# EAGLE design picostepseq (EAGLE 9.6.2)
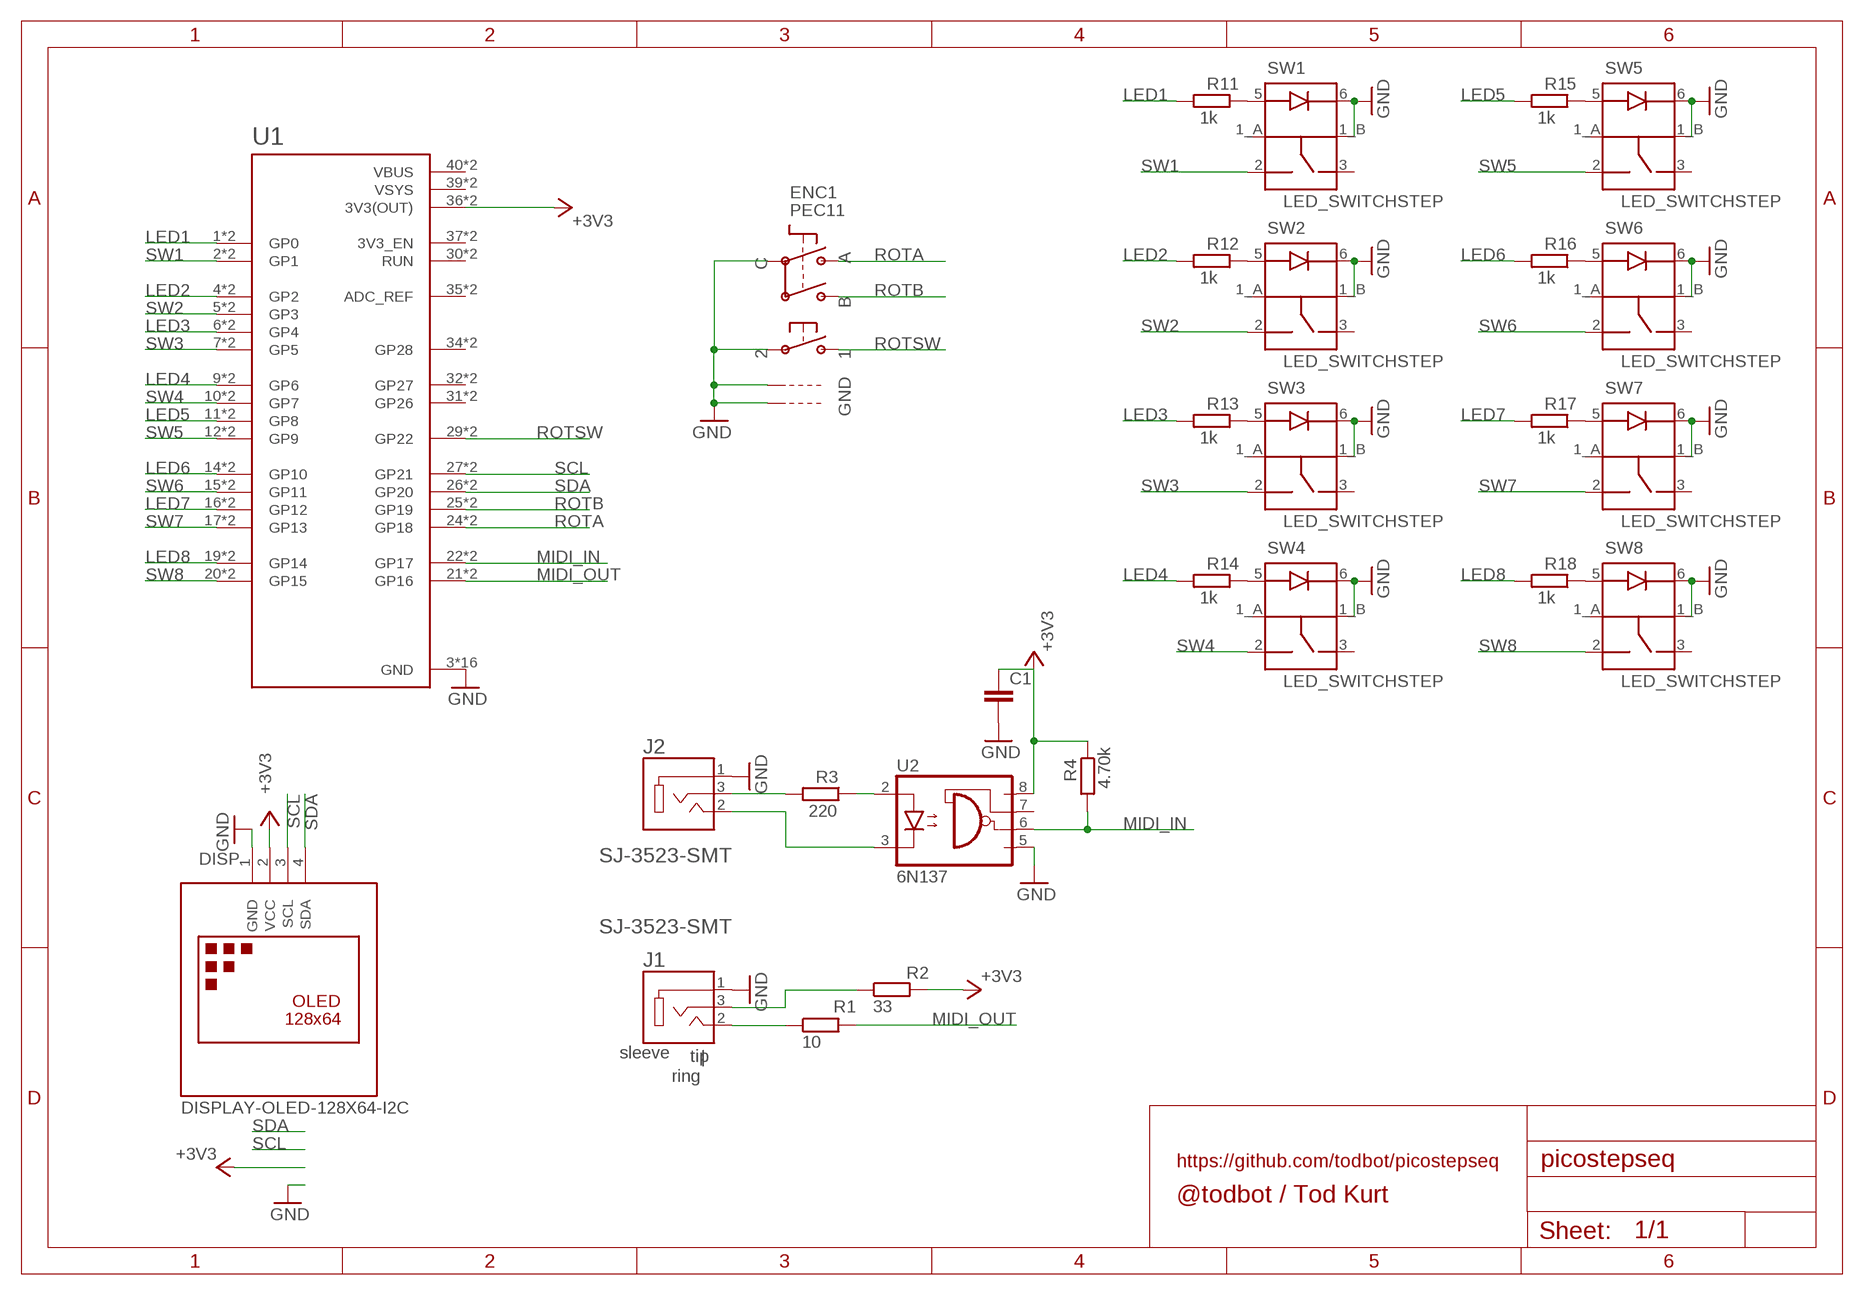
[diagram p0: schematic, sheet 1]

## Parts
C1  C-EU025-025X050  [C025-025X050]
DISP  DISPLAY-OLED-128X64-I2C  [DISPLAY-OLED-128X64-I2C]
ENC1  PEC11  ENCODER_PLUS_SWITCH_BOURNS_PEC11  [PEC11+SWITCH]
J1  SJ-3523-SMT  [CUI_SJ-3523-SMT]
J2  SJ-3523-SMT  [CUI_SJ-3523-SMT]
R1  10  R-EU_0204/7  [0204/7]
R2  33  R-EU_0204/7  [0204/7]
R3  220  R-EU_0204/7  [0204/7]
R4  4.70k  R-EU_0204/7  [0204/7]
R11  1k  R-EU_0204/7  [0204/7]
R12  1k  R-EU_0204/7  [0204/7]
R13  1k  R-EU_0204/7  [0204/7]
R14  1k  R-EU_0204/7  [0204/7]
R15  1k  R-EU_0204/7  [0204/7]
R16  1k  R-EU_0204/7  [0204/7]
R17  1k  R-EU_0204/7  [0204/7]
R18  1k  R-EU_0204/7  [0204/7]
SW1  LED_SWITCHSTEP  [LED_SWITCH_STEP]
SW2  LED_SWITCHSTEP  [LED_SWITCH_STEP]
SW3  LED_SWITCHSTEP  [LED_SWITCH_STEP]
SW4  LED_SWITCHSTEP  [LED_SWITCH_STEP]
SW5  LED_SWITCHSTEP  [LED_SWITCH_STEP]
SW6  LED_SWITCHSTEP  [LED_SWITCH_STEP]
SW7  LED_SWITCHSTEP  [LED_SWITCH_STEP]
SW8  LED_SWITCHSTEP  [LED_SWITCH_STEP]
U1  RASPBERRY_PICO-NO_DEBUG  [PICO-PKG-NO_DEBUG]
U2  6N137  [DIL08]

## Nets
+3V3: C1.1 DISP.2(VCC) R2.2 R4.1 U1.36(3V3(OUT)) U1.P$36(3V3(OUT)) U2.8(VCC)
GND: C1.2 DISP.1(GND) ENC1.P$2 ENC1.P$C ENC1.P$GND1 ENC1.P$GND2 J1.1 J2.1 SW1.1_B SW1.6 SW2.1_B SW2.6 SW3.1_B SW3.6 SW4.1_B SW4.6 SW5.1_B SW5.6 SW6.1_B SW6.6 SW7.1_B SW7.6 SW8.1_B SW8.6 U1.3(GND) U1.8(GND) U1.13(GND) U1.18(GND) U1.23(GND) U1.28(GND) U1.33(GND) U1.38(GND) U1.P$3(GND) U1.P$8(GND) U1.P$13(GND) U1.P$18(GND) U1.P$23(GND) U1.P$28(GND) U1.P$33(GND) U1.P$38(GND) U2.5(GND)
LED1: R11.2 U1.1(GP0) U1.P$1(GP0)
LED2: R12.2 U1.4(GP2) U1.P$4(GP2)
LED3: R13.2 U1.6(GP4) U1.P$6(GP4)
LED4: R14.2 U1.9(GP6) U1.P$9(GP6)
LED5: R15.2 U1.11(GP8) U1.P$11(GP8)
LED6: R16.2 U1.14(GP10) U1.P$14(GP10)
LED7: R17.2 U1.16(GP12) U1.P$16(GP12)
LED8: R18.2 U1.19(GP14) U1.P$19(GP14)
MIDI_IN: R4.2 U1.22(GP17) U1.P$22(GP17) U2.6(VO)
MIDI_OUT: R1.2 U1.21(GP16) U1.P$21(GP16)
N$1: J1.2 R1.1
N$2: R3.1 U2.2(A)
N$4: J2.2 U2.3(C)
N$5: R11.1 SW1.5
N$6: R12.1 SW2.5
N$7: R13.1 SW3.5
N$8: R14.1 SW4.5
N$9: R15.1 SW5.5
N$10: R16.1 SW6.5
N$11: R17.1 SW7.5
N$12: R18.1 SW8.5
N$13: J1.3 R2.1
N$14: J2.3 R3.2
ROTA: ENC1.P$A U1.24(GP18) U1.P$24(GP18)
ROTB: ENC1.P$B U1.25(GP19) U1.P$25(GP19)
ROTSW: ENC1.P$1 U1.29(GP22) U1.P$29(GP22)
SCL: DISP.3(SCL) U1.27(GP21) U1.P$27(GP21)
SDA: DISP.4(SDA) U1.26(GP20) U1.P$26(GP20)
SW1: SW1.2 U1.2(GP1) U1.P$2(GP1)
SW2: SW2.2 U1.5(GP3) U1.P$5(GP3)
SW3: SW3.2 U1.7(GP5) U1.P$7(GP5)
SW4: SW4.2 U1.10(GP7) U1.P$10(GP7)
SW5: SW5.2 U1.12(GP9) U1.P$12(GP9)
SW6: SW6.2 U1.15(GP11) U1.P$15(GP11)
SW7: SW7.2 U1.17(GP13) U1.P$17(GP13)
SW8: SW8.2 U1.20(GP15) U1.P$20(GP15)
Unconnected: SW1.1_A SW1.3 SW2.1_A SW2.3 SW3.1_A SW3.3 SW4.1_A SW4.3 SW5.1_A SW5.3 SW6.1_A SW6.3 SW7.1_A SW7.3 SW8.1_A SW8.3 U1.30(RUN) U1.31(GP26) U1.32(GP27) U1.34(GP28) U1.35(ADC_REF) U1.37(3V3_EN) U1.P$30(RUN) U1.P$31(GP26) U1.P$32(GP27) U1.P$34(GP28) U1.P$35(ADC_REF) U1.P$37(3V3_EN) U2.7(VE)

## Notes on the sheet
- sleeve | tip
- |
  ring
- https://github.com/todbot/picostepseq
- @todbot / Tod Kurt

## Power pins joined to a net without a drawn wire
VBUS: U1.40(VBUS) U1.P$40(VBUS)
VSYS: U1.39(VSYS) U1.P$39(VSYS)

## Library data of the parts
C1 = rcl:C-EU: CAPACITOR, European symbol; SPICEPREFIX: C
DISP = diy-modules:DISPLAY-OLED-128X64-I2C: 128x64 Dot Matrix OLED Module based on SSD1306 chip Variant with I2C interface More details available here: http://www.instructables.com/id/Monochrome-096-i2c-OLED-display-with-arduino-SSD13/ SSD1306 datasheet: https://cdn-shop.adafruit.com/datasheets/SSD1306.pdf Click here to find device on ebay.com <http://www.ebay.com/sch/oled+display+128x64+iic> Note: There are two variants: I2C and SPI. Search for the proper version.
ENC1 = adafruit_electromech:ENCODER_PLUS_SWITCH: Rotary Encoder with Built-In Switch PEC11 - 24 Step, PEC11-4215F-S24 - http://www.adafruit.com/products/377
J1 J2 = SJ-3523-SMT:SJ-3523-SMT: Audio Jack Connector 3.5 mm Low Profile Surface Mount Stereo Jack, 3 Pin Right-Angle; CUI_PURCHASE_URL: https://www.cuidevices.com/product/interconnect/connectors/audio-connectors/jacks/sj-352x-smt-series?utm_source=snapeda.com&utm_medium=referral&utm_campaign=snapedaBOM; DESCRIPTION: 3.5 mm, Stereo, Right Angle, Surface Mount (SMT), 3 Conductors, 0~1 Internal Switches, Audio Jack Connector; DIGI-KEY_PART_NUMBER: CP-3523SJCT-ND; MF: CUI Devices; MP: SJ-3523-SMT-TR; PACKAGE: None; PURCHASE-URL: https://pricing.snapeda.com/search/part/SJ-3523-SMT-TR/?ref=eda
R1-R4 R11-R18 = rcl:R-EU_: RESISTOR, European symbol; SPICEPREFIX: R
SW1-SW8 = todstuff:LED_SWITCH: Step switch with LED, like on old drum machines https://www.adafruit.com/product/5519
U1 = RpiPico:RASPBERRY_PICO-NO_DEBUG
U2 = optocoupler:6N137: MOTOROLA OPTO COUPLER; MPN: 6N137; OC_FARNELL: 1328376; OC_NEWARK: 52M1895

## Board
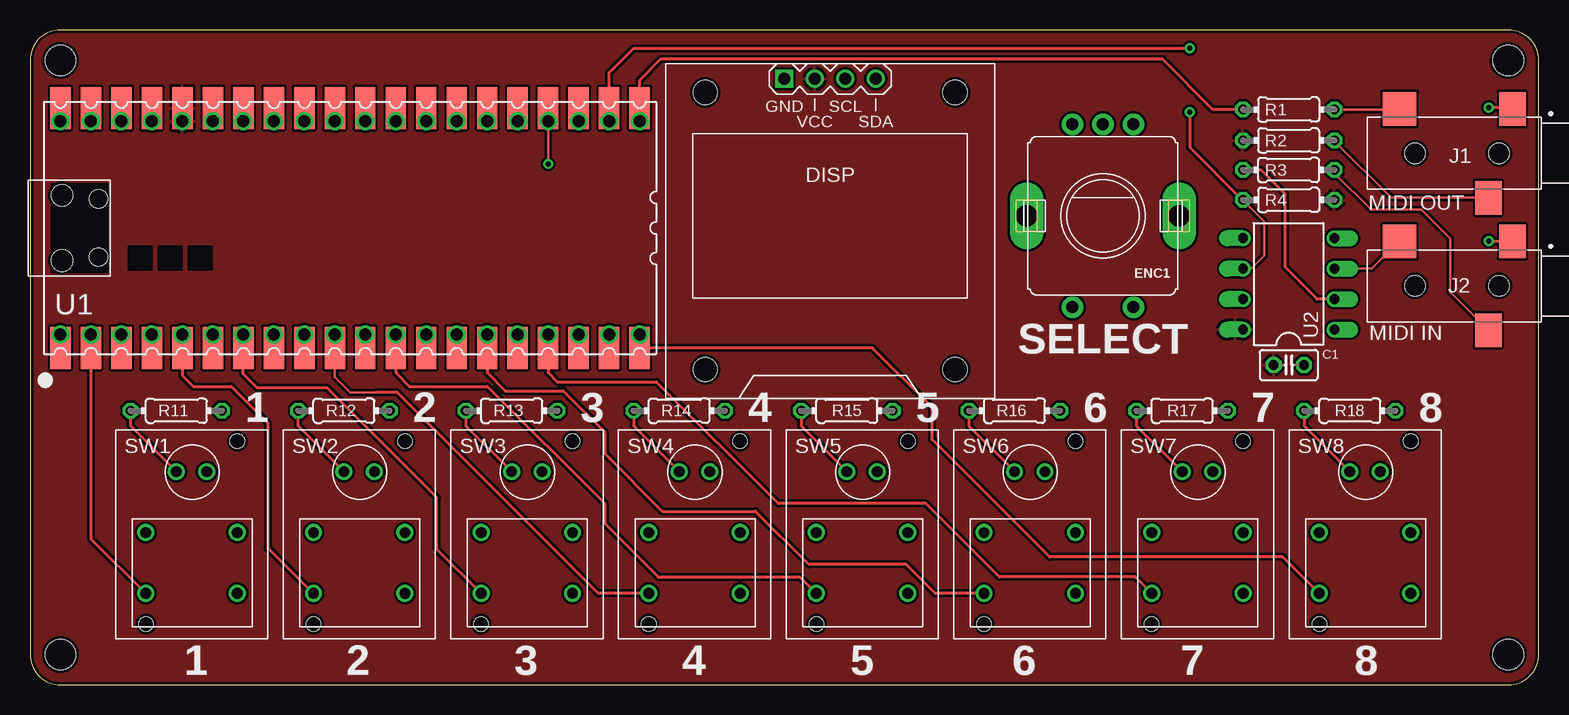
[diagram p1: board, top side]
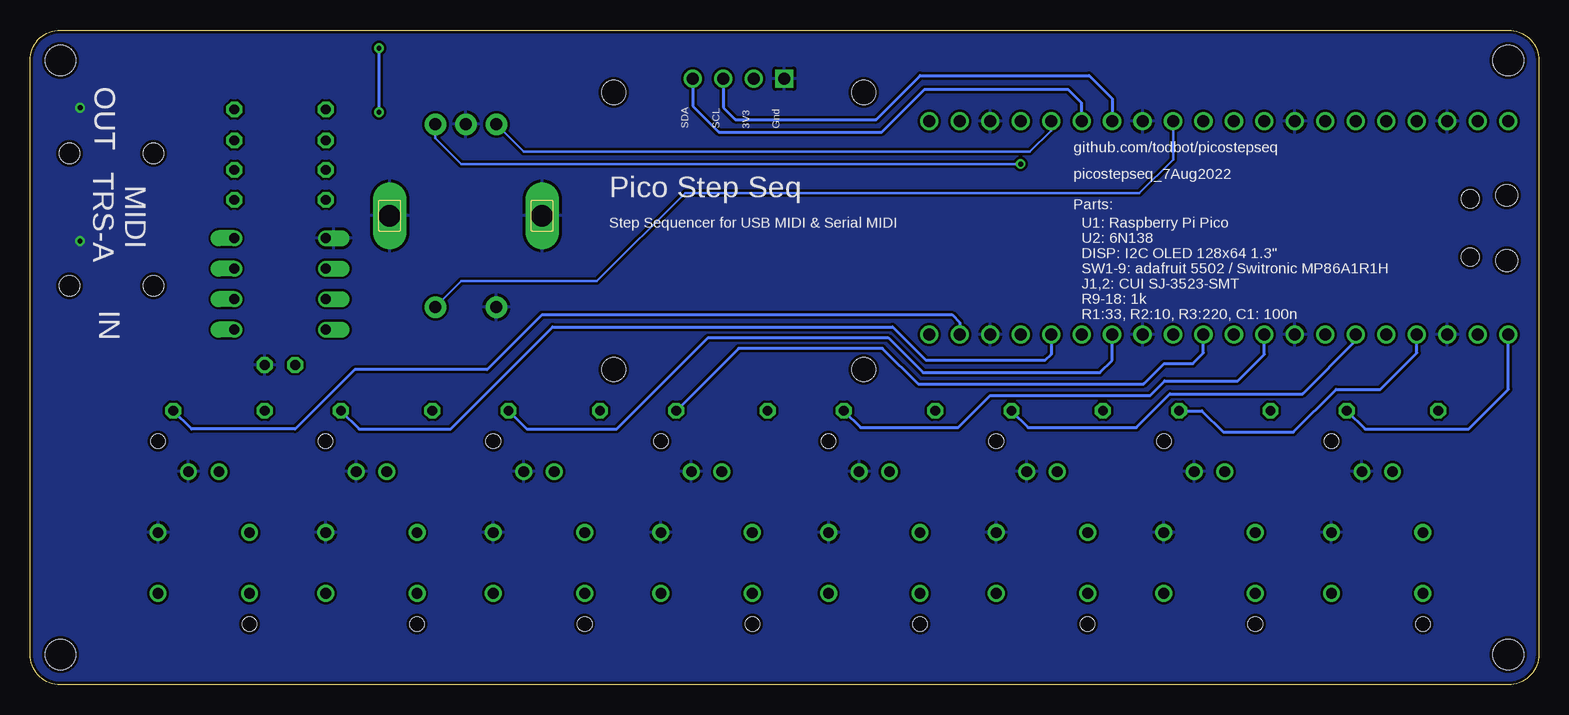
[diagram p2: board, bottom side, seen from below]

Size 125.73 x 54.61 mm. Coordinates in mm from the lower left corner, seen from the top.
Outline: 0,52.07 0,2.54 arc90 2.54,0 123.19,0 arc90 125.73,2.54 125.73,52.07 arc90 123.19,54.61 2.54,54.61 arc90 0,52.07
Copper layers (1*16): Top 0.035mm / dielectric 1.5mm / Bottom 0.035mm
Design rules "adafruit-rules-20180530": minimum track width 8mil, minimum drill 16mil, track to track 8mil, track to pad 8mil, pad to pad 8mil, via to via 8mil, smd to smd 8mil, copper to edge 10mil, drill to drill 8mil, minimum pad ring 10mil, minimum via ring 8mil, stop-mask expansion 4mil, vias tented up to drill 20mil, thermal gap 10mil
Holes 2.54 mm at 2.54,2.54 123.19,2.54 123.19,52.07 2.54,52.07

### Footprints (pad centres in the part's own frame; a part is rotated, then mirrored left to right if it is on the bottom)
C025-025X050 = drill 0.813 octagon: 1 -1.27,0; 2 1.27,0
DISPLAY-OLED-128X64-I2C = drill 1 square: 1 -3.81,12.7 | drill 1: 2 -1.27,12.7; 3 1.27,12.7; 4 3.81,12.7 | hole 2: -10.414,11.557; 10.414,11.557; 10.414,-11.557; -10.414,-11.557
PEC11+SWITCH = drill 1 pad 1.8: P$1 -2.54,7.62; P$2 2.54,7.62; P$A -2.54,-7.62; P$B 2.54,-7.62; P$C 0,-7.62 | drill 1.8 pad 2.8 long: P$GND1 -6.35,0; P$GND2 6.35,0
CUI_SJ-3523-SMT = smd 2.2 x 2.8: 1 -1.1,-3.7; 3 0.9,3.7 | smd 2.8 x 2.8: 2 8.3,-3.7 | hole 1.7: 0,0; 7,0
0204/7 = drill 0.813 octagon: 1 -3.81,0; 2 3.81,0
LED_SWITCH_STEP = drill 0.9: 1_A -3.81,0; 1_B 3.81,0; 2 -3.81,-5.08; 3 3.81,-5.08; 5 -1.27,5.08; 6 1.27,5.08 | hole 1.2: -3.81,-7.62; 3.81,7.62
PICO-PKG-NO_DEBUG = drill 1: 1 -7.62,25.4; 2 -7.62,22.86; 3 -7.62,20.32; 4 -7.62,17.78; 5 -7.62,15.24; 6 -7.62,12.7; 7 -7.62,10.16; 8 -7.62,7.62; 9 -7.62,5.08; 10 -7.62,2.54; 11 -7.62,0; 12 -7.62,-2.54; 13 -7.62,-5.08; 14 -7.62,-7.62; 15 -7.62,-10.16; 16 -7.62,-12.7; 17 -7.62,-15.24; 18 -7.62,-17.78; 19 -7.62,-20.32; 20 -7.62,-22.86; 21 10.16,-22.86; 22 10.16,-20.32; 23 10.16,-17.78; 24 10.16,-15.24; 25 10.16,-12.7; 26 10.16,-10.16; 27 10.16,-7.62; 28 10.16,-5.08; 29 10.16,-2.54; 30 10.16,0; 31 10.16,2.54; 32 10.16,5.08; 33 10.16,7.62; 34 10.16,10.16; 35 10.16,12.7; 36 10.16,15.24; 37 10.16,17.78; 38 10.16,20.32; 39 10.16,22.86; 40 10.16,25.4 | smd 3.5 x 1.7: P$1 -8.73,25.4; P$2 -8.73,22.86; P$3 -8.73,20.32; P$4 -8.73,17.78; P$5 -8.73,15.24; P$6 -8.73,12.7; P$7 -8.73,10.16; P$8 -8.73,7.62; P$9 -8.73,5.08; P$10 -8.73,2.54; P$11 -8.73,0; P$12 -8.73,-2.54; P$13 -8.73,-5.08; P$14 -8.73,-7.62; P$15 -8.73,-10.16; P$16 -8.73,-12.7; P$17 -8.73,-15.24; P$18 -8.73,-17.78; P$19 -8.73,-20.32; P$20 -8.73,-22.86; P$21 11.27,-22.86; P$22 11.27,-20.32; P$23 11.27,-17.78; P$24 11.27,-15.24; P$25 11.27,-12.7; P$26 11.27,-10.16; P$27 11.27,-7.62; P$28 11.27,-5.08; P$29 11.27,-2.54; P$30 11.27,0; P$31 11.27,2.54; P$32 11.27,5.08; P$33 11.27,7.62; P$34 11.27,10.16; P$35 11.27,12.7; P$36 11.27,15.24; P$37 11.27,17.78; P$38 11.27,20.32; P$39 11.27,22.86; P$40 11.27,25.4 | hole 1.8: -1.455,25.27; 3.995,25.27 | hole 1.5: -1.155,22.24; 3.695,22.24
DIL08 = drill 0.813 offset: 1 -3.81,-3.81; 2 -1.27,-3.81; 3 1.27,-3.81; 4 3.81,-3.81; 5 3.81,3.81; 6 1.27,3.81; 7 -1.27,3.81; 8 -3.81,3.81

### Placement (x,y rotation side)
C1  104.9,26.67 0 top
DISP  66.67,37.85 0 top
ENC1  89.41,39.12 180 top
J1  122.43,44.32 180 top
J2  122.43,33.27 180 top
R1  104.89,47.98 180 top
R2  104.89,45.4 180 top
R3  104.89,42.94 0 top
R4  104.89,40.44 180 top
R11  12.19,22.86 0 top
R12  26.16,22.86 0 top
R13  40.13,22.86 0 top
R14  54.1,22.86 0 top
R15  68.07,22.86 0 top
R16  82.04,22.86 0 top
R17  96.01,22.86 0 top
R18  109.98,22.86 0 top
SW1  13.46,12.7 0 top
SW2  27.43,12.7 0 top
SW3  41.4,12.7 0 top
SW4  55.37,12.7 0 top
SW5  69.34,12.7 0 top
SW6  83.31,12.7 0 top
SW7  97.28,12.7 0 top
SW8  111.25,12.7 0 top
U1  27.94,36.83 90 top
U2  104.89,33.44 90 top

### Tracks (layer width: path | path; a pad name or v marks a point on that pad's centre or on a via)
+3V3
  pour Top: 125.99,54.69 125.99,-1.02 -0.4,-1.02 -0.4,54.69
GND  (via drill 0.41)
  Top 0.254: J1.1 123.42,48.13 v121.56,48.13 | J2.1 121.6,36.97 v121.56,37.01 | U1.P$3 U1.3 | U1.P$8 U1.8 | U1.P$13 U1.13 | U1.P$18 U1.18 | U1.P$28 U1.28 | U1.P$33 U1.33 | U1.P$38 U1.38 | U1.P$23 U1.23
  pour Bottom: 0,54.42 125.73,54.42 125.73,0 0,0
LED1
  Top 0.254: U1.P$1 U1.1
  Bottom 0.254: R11.2 14.48,21.34 5.84,21.34 2.54,24.64 U1.1
LED2
  Top 0.254: U1.P$4 U1.4
  Bottom 0.254: R12.2 28.07,22.86 26.29,21.08 20.45,21.08 16.89,24.64 13.21,24.64 10.16,27.69 U1.4
LED3
  Top 0.254: U1.P$6 U1.6
  Bottom 0.254: R13.2 42.55,21.46 33.53,21.46 30.73,24.26 19.68,24.26 15.24,28.7 U1.6
LED4
  Top 0.254: U1.P$9 U1.9
  Bottom 0.254: R14.2 56.52,21.46 48.39,21.46 45.72,24.13 32.39,24.13 31.17,25.35 25.07,25.35 22.86,27.56 U1.9
LED5
  Top 0.254: U1.P$11 U1.11
  Bottom 0.254: R15.2 66.67,28.07 54.69,28.07 51.72,25.09 32.93,25.09 31.23,26.8 28.83,26.8 27.94,27.69 U1.11
LED6
  Top 0.254: U1.P$14 U1.14
  Bottom 0.254: R16.2 84.33,21.34 76.83,21.34 69.22,28.96 54.23,28.96 51.31,26.04 36.58,26.04 35.56,27.05 U1.14
LED7
  Top 0.254: U1.P$16 U1.16
  Bottom 0.254: R17.2 98.3,21.34 90.68,21.34 82.17,29.84 53.85,29.84 51.05,27.05 41.15,27.05 40.64,27.56 U1.16
LED8
  Top 0.254: U1.P$19 U1.19
  Bottom 0.254: R18.2 112.27,21.34 103.63,21.34 98.68,26.29 87.63,26.29 83.06,30.86 48.9,30.86 48.26,30.23 U1.19
MIDI_IN  (via drill 0.41)
  Top 0.203: R4.2 102.87,38.65 102.87,35.81 101.77,34.71 U2.6
  Top 0.254: R4.2 101.04,40.44 96.65,44.83 v96.65,47.75 | U1.22 U1.P$22 48.26,51.05 50.29,53.09 v96.65,53.09
  Bottom 0.254: v96.65,53.09 v96.65,47.75
MIDI_OUT
  Top 0.254: U1.21 U1.P$21 50.8,50.42 52.58,52.2 94.36,52.2 98.58,47.98 R1.2
N$1
  Top 0.203: R1.1 114.08,47.98 J1.2
N$2
  Top 0.254: U2.2 107.26,32.17 104.59,34.84 104.59,40.94 102.59,42.94 R3.1
N$4
  Top 0.203: U2.3 111.8,34.71 114.06,36.97 J2.2
N$5
  Top 0.254: SW1.5 8.38,21.59 R11.1
N$6
  Top 0.254: SW2.5 22.35,21.59 R12.1
N$7
  Top 0.254: SW3.5 36.32,21.59 R13.1
N$8
  Top 0.254: R14.1 50.29,21.59 SW4.5
N$9
  Top 0.254: R15.1 64.26,21.59 SW5.5
N$10
  Top 0.254: R16.1 78.23,21.59 SW6.5
N$11
  Top 0.254: R17.1 92.2,21.59 SW7.5
N$12
  Top 0.254: R18.1 106.17,21.59 SW8.5
N$13
  Top 0.203: J1.3 113.43,40.62 108.7,45.35 R2.1
N$14
  Top 0.203: R3.2 108.7,42.68 111.76,39.62 115.95,39.62 118.36,37.21 118.36,32.74 J2.3
ROTA  (via drill 0.41)
  Top 0.203: U1.24 U1.P$24 v43.18,43.43
  Bottom 0.203: ENC1.P$A 91.95,45.59 89.79,43.43 v43.18,43.43
ROTB
  Top 0.203: U1.P$25 U1.25
  Bottom 0.203: U1.25 40.64,46.23 42.42,44.45 84.58,44.45 ENC1.P$B
ROTSW
  Top 0.203: U1.P$29 U1.29
  Bottom 0.203: ENC1.P$1 89.79,33.66 78.49,33.66 71.12,41.02 33.27,41.02 30.48,43.81 U1.29
SCL
  Top 0.254: U1.P$27 U1.27
  Bottom 0.254: DISP.3 67.94,48.13 66.94,47.13 55.23,47.13 51.56,50.8 37.47,50.8 35.56,48.9 U1.27
SDA
  Top 0.254: U1.P$26 U1.26
  Bottom 0.254: U1.26 38.1,48.51 39.24,49.66 51.18,49.66 54.74,46.1 68.33,46.1 70.48,48.26 DISP.4
SW1
  Top 0.254: SW1.2 5.08,12.19 U1.P$2 U1.2
SW2
  Top 0.254: SW2.2 19.89,11.35 19.81,11.35 19.81,21.84 16.76,24.89 13.59,24.89 12.7,25.78 U1.P$5 U1.5
SW3
  Top 0.254: SW3.2 33.91,11.3 33.91,15.62 24.77,24.77 18.92,24.77 17.78,25.91 U1.P$7 U1.7
SW4
  Top 0.203: 28.83,24.38 26.67,24.38 25.4,25.65 25.4,27.81
  Top 0.254: U1.10 U1.P$10 25.4,27.81 | 28.83,24.38 30.6,24.38 47.36,7.62 SW4.2
SW5
  Top 0.254: U1.12 U1.P$12 30.48,26.04 31.62,24.89 38.1,24.89 47.88,15.11 47.88,13.47 52.35,9 64.15,9 SW5.2
SW6
  Top 0.254: SW6.2 75.44,7.62 73.03,10.03 64.9,10.03 60.45,14.48 52.7,14.48 47.88,19.3 47.88,21.08 44.45,24.51 39.62,24.51 38.1,26.04 U1.P$15 U1.15
SW7
  Top 0.254: U1.17 U1.P$17 43.18,26.04 43.94,25.27 52.2,25.27 62.36,15.11 74.66,15.11 80.77,9 92.09,9 SW7.2
SW8
  Top 0.254: SW8.2 104.39,10.67 84.96,10.67 75.18,20.45 75.18,23.11 70.2,28.1 U1.P$20 U1.20
VBUS
  Top 0.254: U1.P$40 U1.40
VSYS
  Top 0.254: U1.P$39 U1.39

### Text on the board
tPlace: MIDI OUT | SELECT | MIDI IN | 1 | 2 | 3 | 4 | 5 | 6 | 7 | 8 | 1 | 2 | 3 | 4 | 5 | 6 | 7 | 8
bPlace: OUT | Gnd | 3V3 | SCL | SDA | github.com/todbot/picostepseq | picostepseq_7Aug2022 | Pico Step Seq | Parts: | MIDI / TRS-A | U1: Raspberry Pi Pico | Step Sequencer for USB MIDI & Serial MIDI | U2: 6N138 | DISP: I2C OLED 128x64 1.3" | SW1-9: adafruit 5502 / Switronic MP86A1R1H | J1,2: CUI SJ-3523-SMT | R9-18: 1k | R1:33, R2:10, R3:220, C1: 100n | IN